# Altium schematic sheet BMP390.SchDoc
size A; SheetNumber: 6; SheetTotal: 7
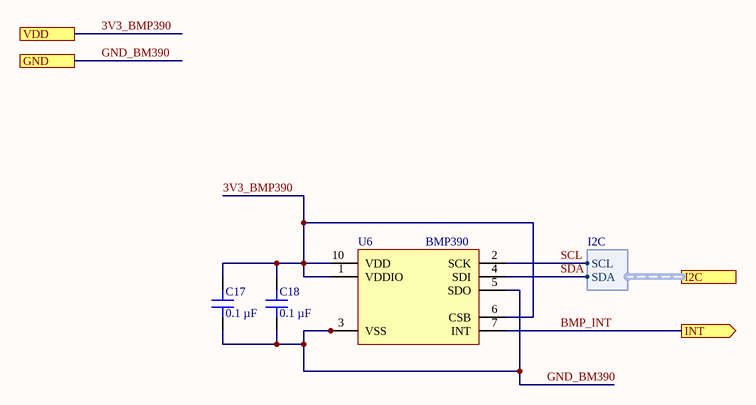
[diagram p0: BMP390.SchDoc]

## Parts
C17  0.1 µF  [CAP 0402_1005]
C18  0.1 µF  [CAP 0402_1005]
U6  BMP390  [BMP390L]

## Ports
GND, I2C (harness I2C), INT (out), VDD

## Harnesses
I2C: SCL, SDA

## Nets
3V3_BMP390: C17.2 C18.2 U6.1(VDDIO) U6.6(CSB) U6.10(VDD) ; port VDD
BMP_INT: U6.7(INT) ; port INT
GND_BM390: C17.1 C18.1 U6.3(VSS) U6.5(SDO) U6.8(VSS) U6.9(VSS) ; port GND
SCL: U6.2(SCK) ; port I2C.SCL
SDA: U6.4(SDI) ; port I2C.SDA

## Library data of the parts
C17 C18 = C0402C104K4RACAUTO: CAP CER 0.1UF 16V X7R 0402; manufacturer: KEMET; Tolerance: ±10%; Part Number: C0402C104K4RACAUTO; Value: 0.1 µF; Applications: Automotive, Bypass, Decoupling; Capacitance: 0.1 µF; componentlink1description: Datasheet; componentlink1url: https://api.kemet.com/component-edge/download/specsheet/C0402C104K4RACAUTO.pdf; componentlink2description: DigiKey Link; componentlink2url: https://www.digikey.com/en/products/detail/kemet/C0402C104K4RACAUTO/3314827; Device Package: 0402 (1005 Metric); lastupdated: 8/14/2022 9:05:51 PM; Lifecycle Status: Active; Minimum Order: 1; Mounting Type: Surface Mount, MLCC; Operating Temperature: -55°C ~ 125°C; Package / Case: 0402 (1005 Metric); packaging: TapeAndReel; partid: 3024; Part Status: Active; price: 0.01; Ratings: AEC-Q200; series: SMD Auto X7R; Size / Dimension: 0.039" L x 0.020" W (1.00mm x 0.50mm); Supplier 1: DigiKey; Supplier Part Number 1: 399-6828-1-ND; Temperature Coefficient: X7R; Thickness (Max): 0.022" (0.55mm); Voltage - Rated: 16V
U6 = BMP390: Altimeter